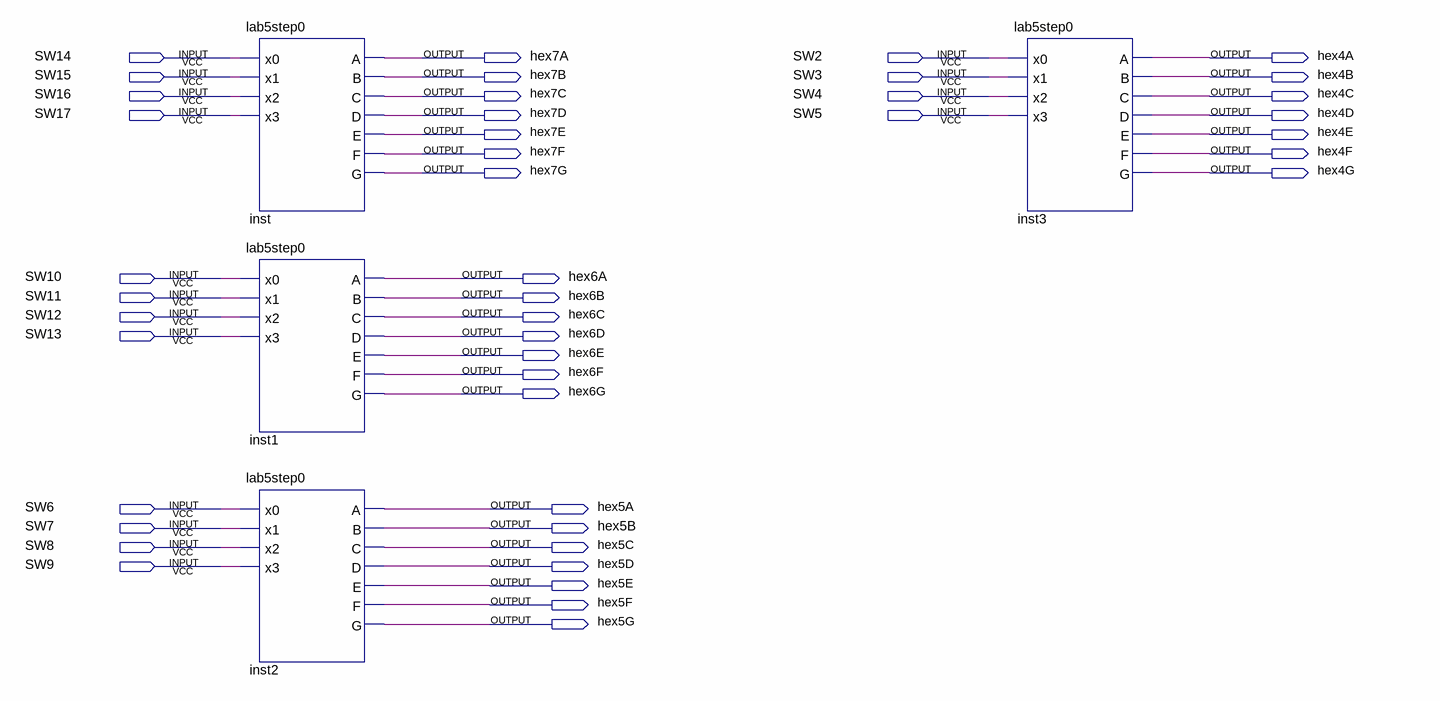
[diagram p0: schematic sheet]
// Quartus schematic lab5step1.bdf as structural Verilog: 4 symbols, 44 pins
module lab5step1 (
  input  SW14,
  input  SW2,
  input  SW15,
  input  SW3,
  input  SW16,
  input  SW4,
  input  SW17,
  input  SW5,
  input  SW10,
  input  SW11,
  input  SW12,
  input  SW13,
  input  SW6,
  input  SW7,
  input  SW8,
  input  SW9,
  output hex7A,
  output hex4A,
  output hex7B,
  output hex4B,
  output hex7C,
  output hex4C,
  output hex7D,
  output hex4D,
  output hex7E,
  output hex4E,
  output hex7F,
  output hex4F,
  output hex7G,
  output hex4G,
  output hex6A,
  output hex6B,
  output hex6C,
  output hex6D,
  output hex6E,
  output hex6F,
  output hex6G,
  output hex5A,
  output hex5B,
  output hex5C,
  output hex5D,
  output hex5E,
  output hex5F,
  output hex5G
);

  lab5step0 inst (
    .x0(SW14), .x1(SW15), .x2(SW16), .x3(SW17), .A(hex7A), .B(hex7B), .C(hex7C), .D(hex7D), .E(hex7E),
    .F(hex7F), .G(hex7G));
  lab5step0 inst1 (
    .x0(SW10), .x1(SW11), .x2(SW12), .x3(SW13), .A(hex6A), .B(hex6B), .C(hex6C), .D(hex6D), .E(hex6E),
    .F(hex6F), .G(hex6G));
  lab5step0 inst2 (
    .x0(SW6), .x1(SW7), .x2(SW8), .x3(SW9), .A(hex5A), .B(hex5B), .C(hex5C), .D(hex5D), .E(hex5E), .F(hex5F),
    .G(hex5G));
  lab5step0 inst3 (
    .x0(SW2), .x1(SW3), .x2(SW4), .x3(SW5), .A(hex4A), .B(hex4B), .C(hex4C), .D(hex4D), .E(hex4E), .F(hex4F),
    .G(hex4G));
endmodule
